# EasyEDA schematic SCH_Rubik 2_2024-01-29.json
TITLE: Sheet_1; REV: 1.0; Date: 2024-01-09; Sheet: 1/1; Drawn By: aitorgorixo; Company: Your Company
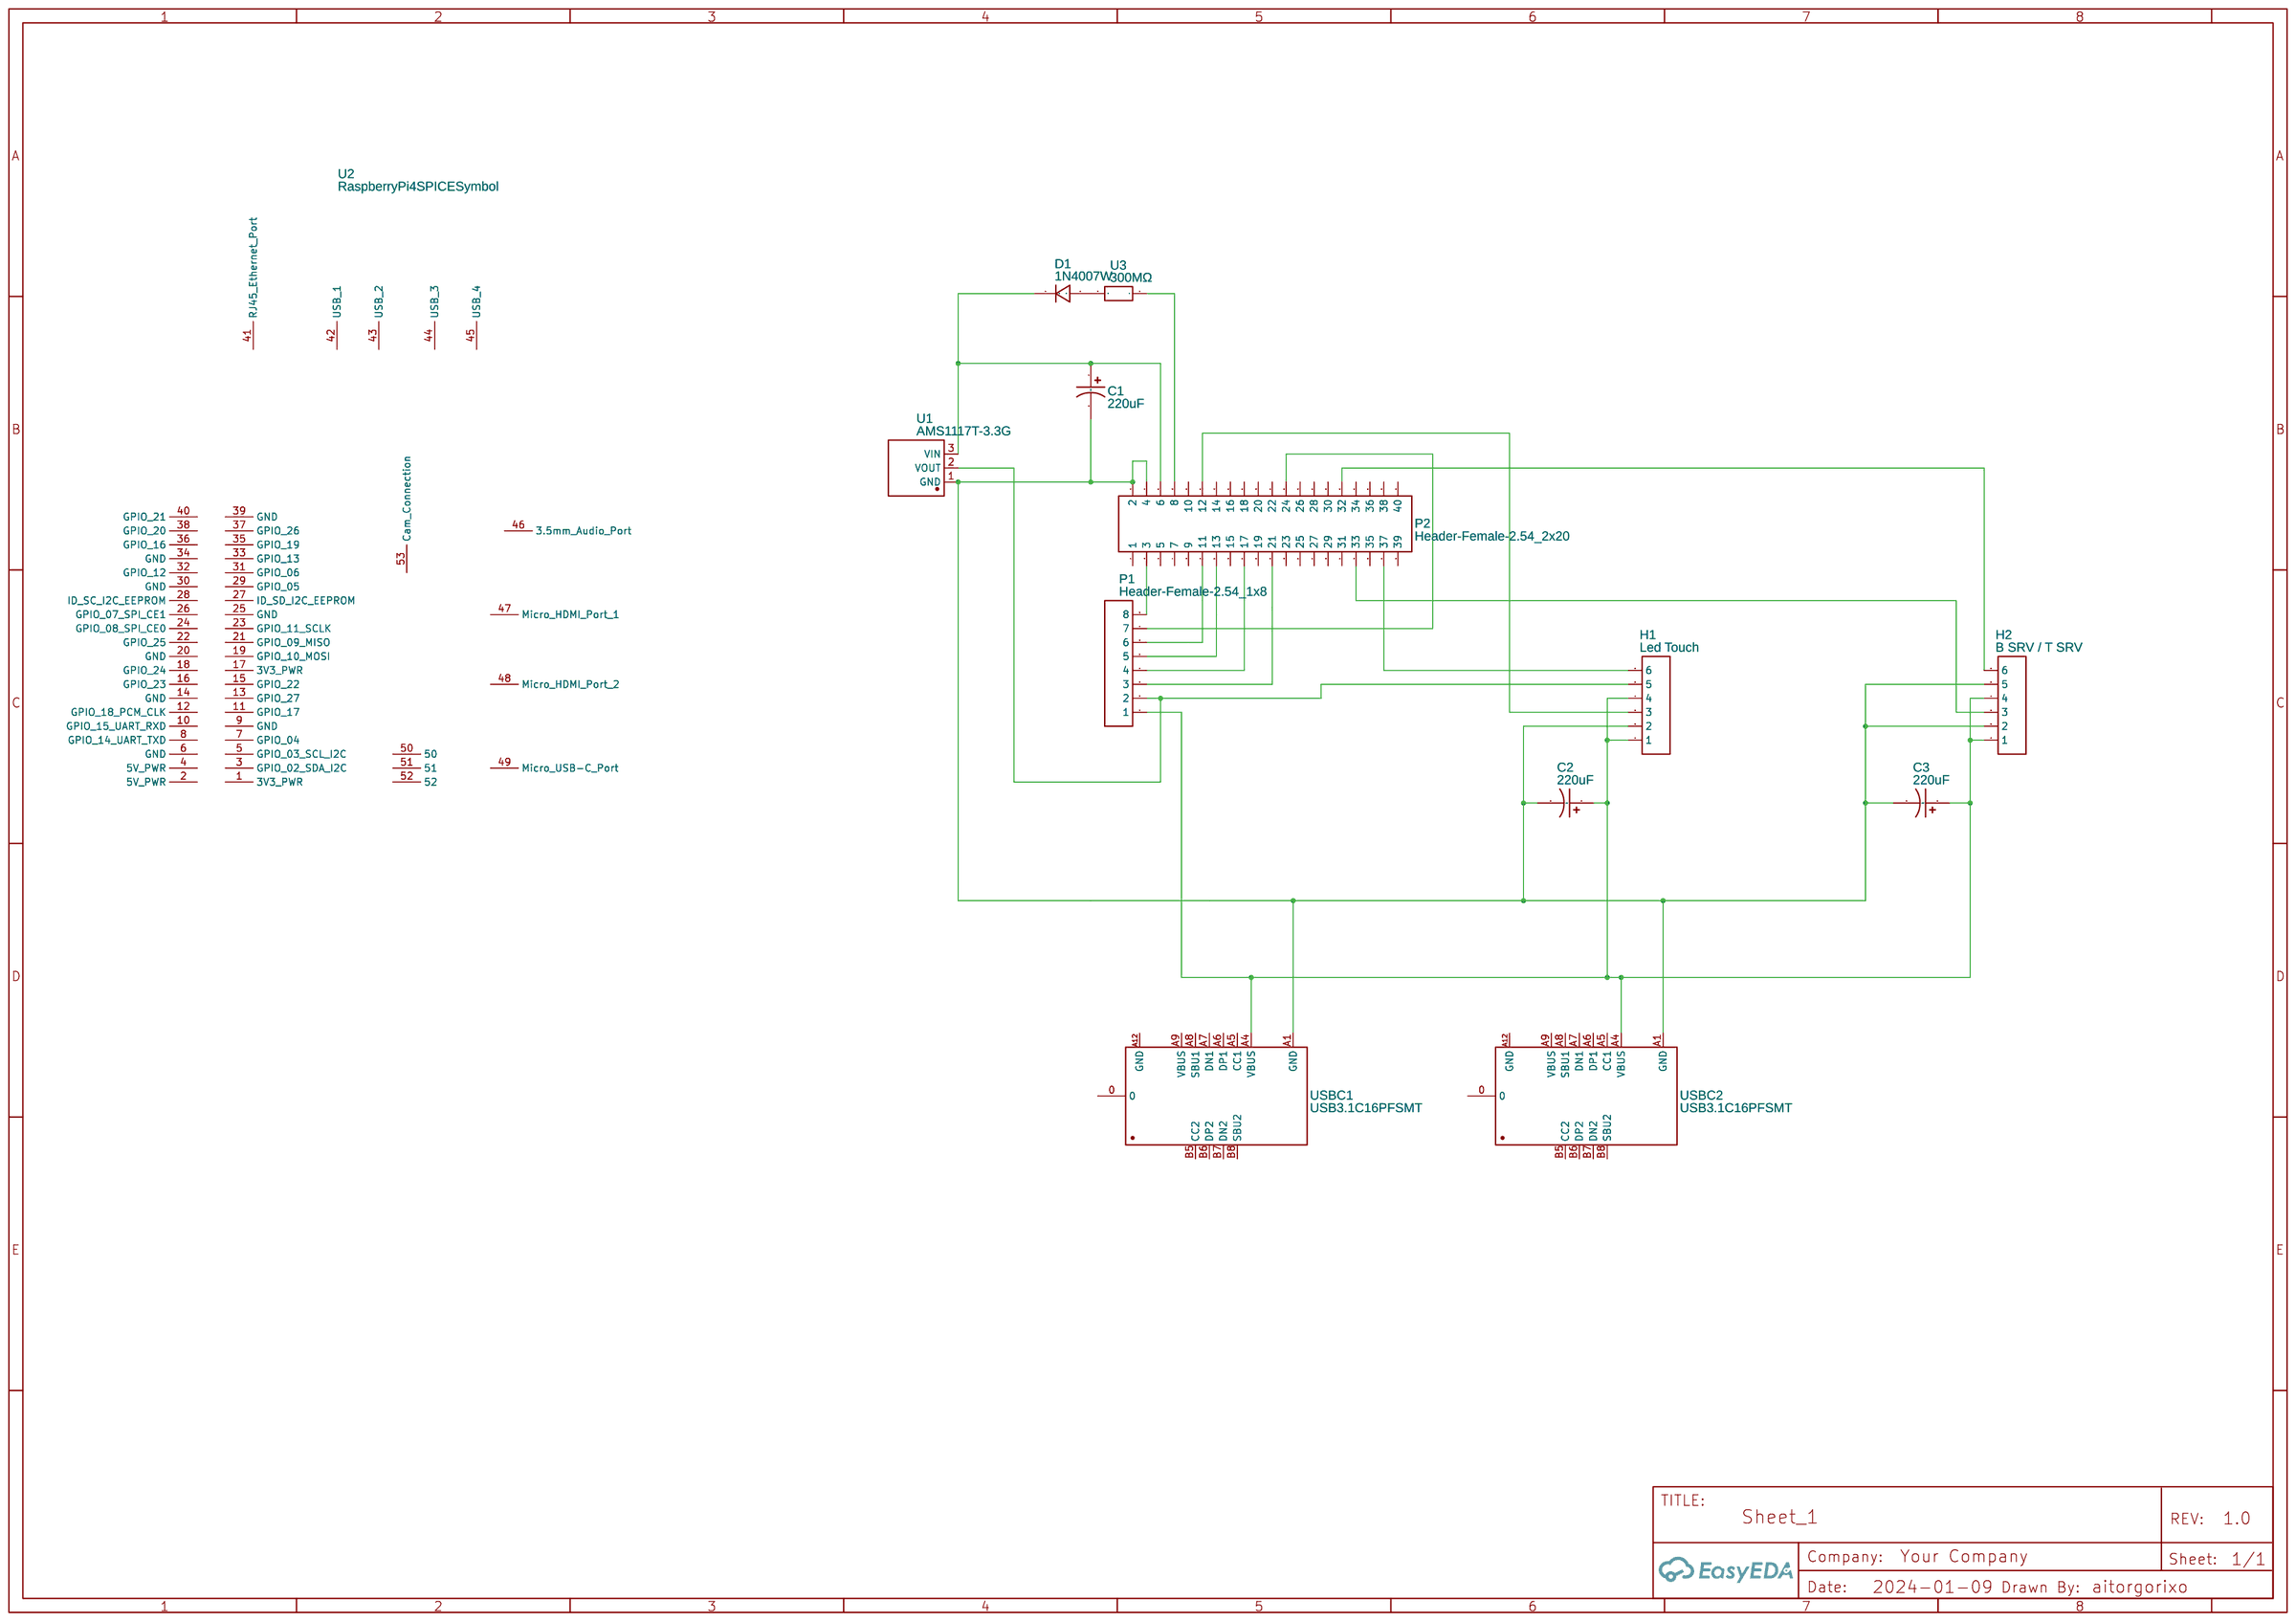
[diagram p0: schematic sheet]

## Parts
C1  220uF  [CAP-TH_BD8.0-P3.50-D0.6-FD_1]
C2  220uF  [CAP-TH_BD8.0-P3.50-D0.6-FD_1]
C3  220uF  [CAP-TH_BD8.0-P3.50-D0.6-FD_1]
D1  1N4007W  [SOD-123_L2.8-W1.8-LS3.7-RD]
H1  Led Touch  [HDR-TH_6P-P2.54-V-M-1]
H2  B SRV / T SRV  [HDR-TH_6P-P2.54-V-M-1]
P1  Header-Female-2.54_1x8  [HDR-TH_8P-P2.54-V-F-1]
P2  Header-Female-2.54_2x20  [HDR-TH_40P-P2.54-V-F-R2-C20-S2.54]
U1  AMS1117T-3.3G  [TO-220-3_L10.0-W4.5-P2.54-L]
U2  RaspberryPi4SPICESymbol  [RASBERRYPI4PCBLIB]
U3  300MΩ  [RES-TH_BD2.8-L8.0-P12.0-D0.7]
USBC1  USB3.1C16PFSMT  [USB-C-SMD_TYPE-C-USB-17]
USBC2  USB3.1C16PFSMT  [USB-C-SMD_TYPE-C-USB-17]

## Library data of the parts
C1-C3 = 35YXG220MLLCT78X16: Contributor: lcsc; Supplier: LCSC; Supplier Part: C2961678; Manufacturer: rubycon(红宝石); JLCPCB Part Class: Extended Part
D1 = 1N4007W: Supplier: LCSC; Supplier Part: C328592; Manufacturer: BLUE ROCKET; Contributor: LCEDA_Lib
H1 H2 = Header-Male-2.54_1x6: Supplier: LCSC; Manufacturer: BOOMELE(博穆精密); Manufacturer Part: 2.54-1x6P直针; Supplier Part: C37208; JLCPCB Part Class: Extended Part
P1 = Header-Female-2.54_1x8: Supplier: LCSC; Manufacturer: BOOMELE(博穆精密); Manufacturer Part: 2.54-1*8P母环保; Supplier Part: C27438; JLCPCB Part Class: Extended Part
P2 = Header-Female-2.54_2x20: Supplier: LCSC; Manufacturer: BOOMELE(博穆精密); Manufacturer Part: 2.54-2*20P母; Supplier Part: C50982; JLCPCB Part Class: Extended Part
U1 = AMS1117T-3.3G: Contributor: lcsc; Supplier: LCSC; Supplier Part: C2977163; Manufacturer: HGC(深圳汉芯); JLCPCB Part Class: Extended Part
U2 = RaspberryPi4SPICESymbol: catid: 20; Contributor: Sanjaya Dharmasena; sim: true
U3 = WW12JTR300: Contributor: lcsc; Supplier: LCSC; Supplier Part: C2593886; Manufacturer: SEI(Stackpole Electronics Inc.)
USBC1 USBC2 = USB3.1C16PFSMT: Contributor: LCSC; Supplier: LCSC; Supplier Part: C167321; Manufacturer: 精拓金; Manufacturer Part: 918-418K2023S40001; JLCPCB Part Class: Extended Part

## Nets
Net-(C1-1): C1.1 D1.1 P2.6 U1.3(VIN)
Net-(C1-2): C1.2 C2.2 C3.2 H1.2 H2.2 H2.5 P2.2 P2.4 U1.1(GND) USBC1.A1(GND) USBC2.A1(GND)
Net-(C2-1): C2.1 C3.1 H1.1 H1.4 H2.1 H2.4 P1.1 USBC1.A4(VBUS) USBC2.A4(VBUS)
Net-(D1-2): D1.2 U3.2
Net-(H1-3): H1.3 P2.12
Net-(H1-5): H1.5 P1.2 U1.2(VOUT)
Net-(H1-6): H1.6 P2.37
Net-(H2-3): H2.3 P2.33
Net-(H2-6): H2.6 P2.32
Net-(P1-3): P1.3 P2.21
Net-(P1-4): P1.4 P2.17
Net-(P1-5): P1.5 P2.13
Net-(P1-6): P1.6 P2.11
Net-(P1-7): P1.7 P2.24
Net-(P1-8): P1.8 P2.3
Net-(P2-8): P2.8 U3.1

Not connected (* = marked no-connect by the designer): P2 1 5 7 9 10 14 15 16 18 19 20 22 23 25 26 27 28 29 30 31 34 35 36 38 39 40; U2 1(3V3 PWR) 2(5V PWR) 3(GPIO 02 SDA I2C) 4(5V PWR) 5(GPIO 03 SCL I2C) 6(GND) 7(GPIO 04) 8(GPIO 14 UART TXD) 9(GND) 10(GPIO 15 UART RXD) 11(GPIO 17) 12(GPIO 18 PCM CLK) 13(GPIO 27) 14(GND) 15(GPIO 22) 16(GPIO 23) 17(3V3 PWR) 18(GPIO 24) 19(GPIO 10 MOSI) 20(GND) 21(GPIO 09 MISO) 22(GPIO 25) 23(GPIO 11 SCLK) 24(GPIO 08 SPI CE0) 25(GND) 26(GPIO 07 SPI CE1) 27(ID_SD I2C EEPROM) 28(ID_SC I2C EEPROM) 29(GPIO 05) 30(GND) 31(GPIO 06) 32(GPIO 12) 33(GPIO 13) 34(GND) 35(GPIO 19) 36(GPIO 16) 37(GPIO 26) 38(GPIO 20) 39(GND) 40(GPIO 21) 41(RJ45 Ethernet Port) 42(USB 1) 43(USB 2) 44(USB 3) 45(USB 4) 46(3.5mm Audio Port) 47(Micro HDMI Port 1) 48(Micro HDMI Port 2) 49(Micro USB-C Port) 50 51 52 53(Cam Connection); USBC1 0 A5(CC1) A6(DP1) A7(DN1) A8(SBU1) A9(VBUS) A12(GND) B5(CC2) B6(DP2) B7(DN2) B8(SBU2); USBC2 0 A5(CC1) A6(DP1) A7(DN1) A8(SBU1) A9(VBUS) A12(GND) B5(CC2) B6(DP2) B7(DN2) B8(SBU2)
